# EAGLE design Quadcopter (EAGLE 7.7.0)
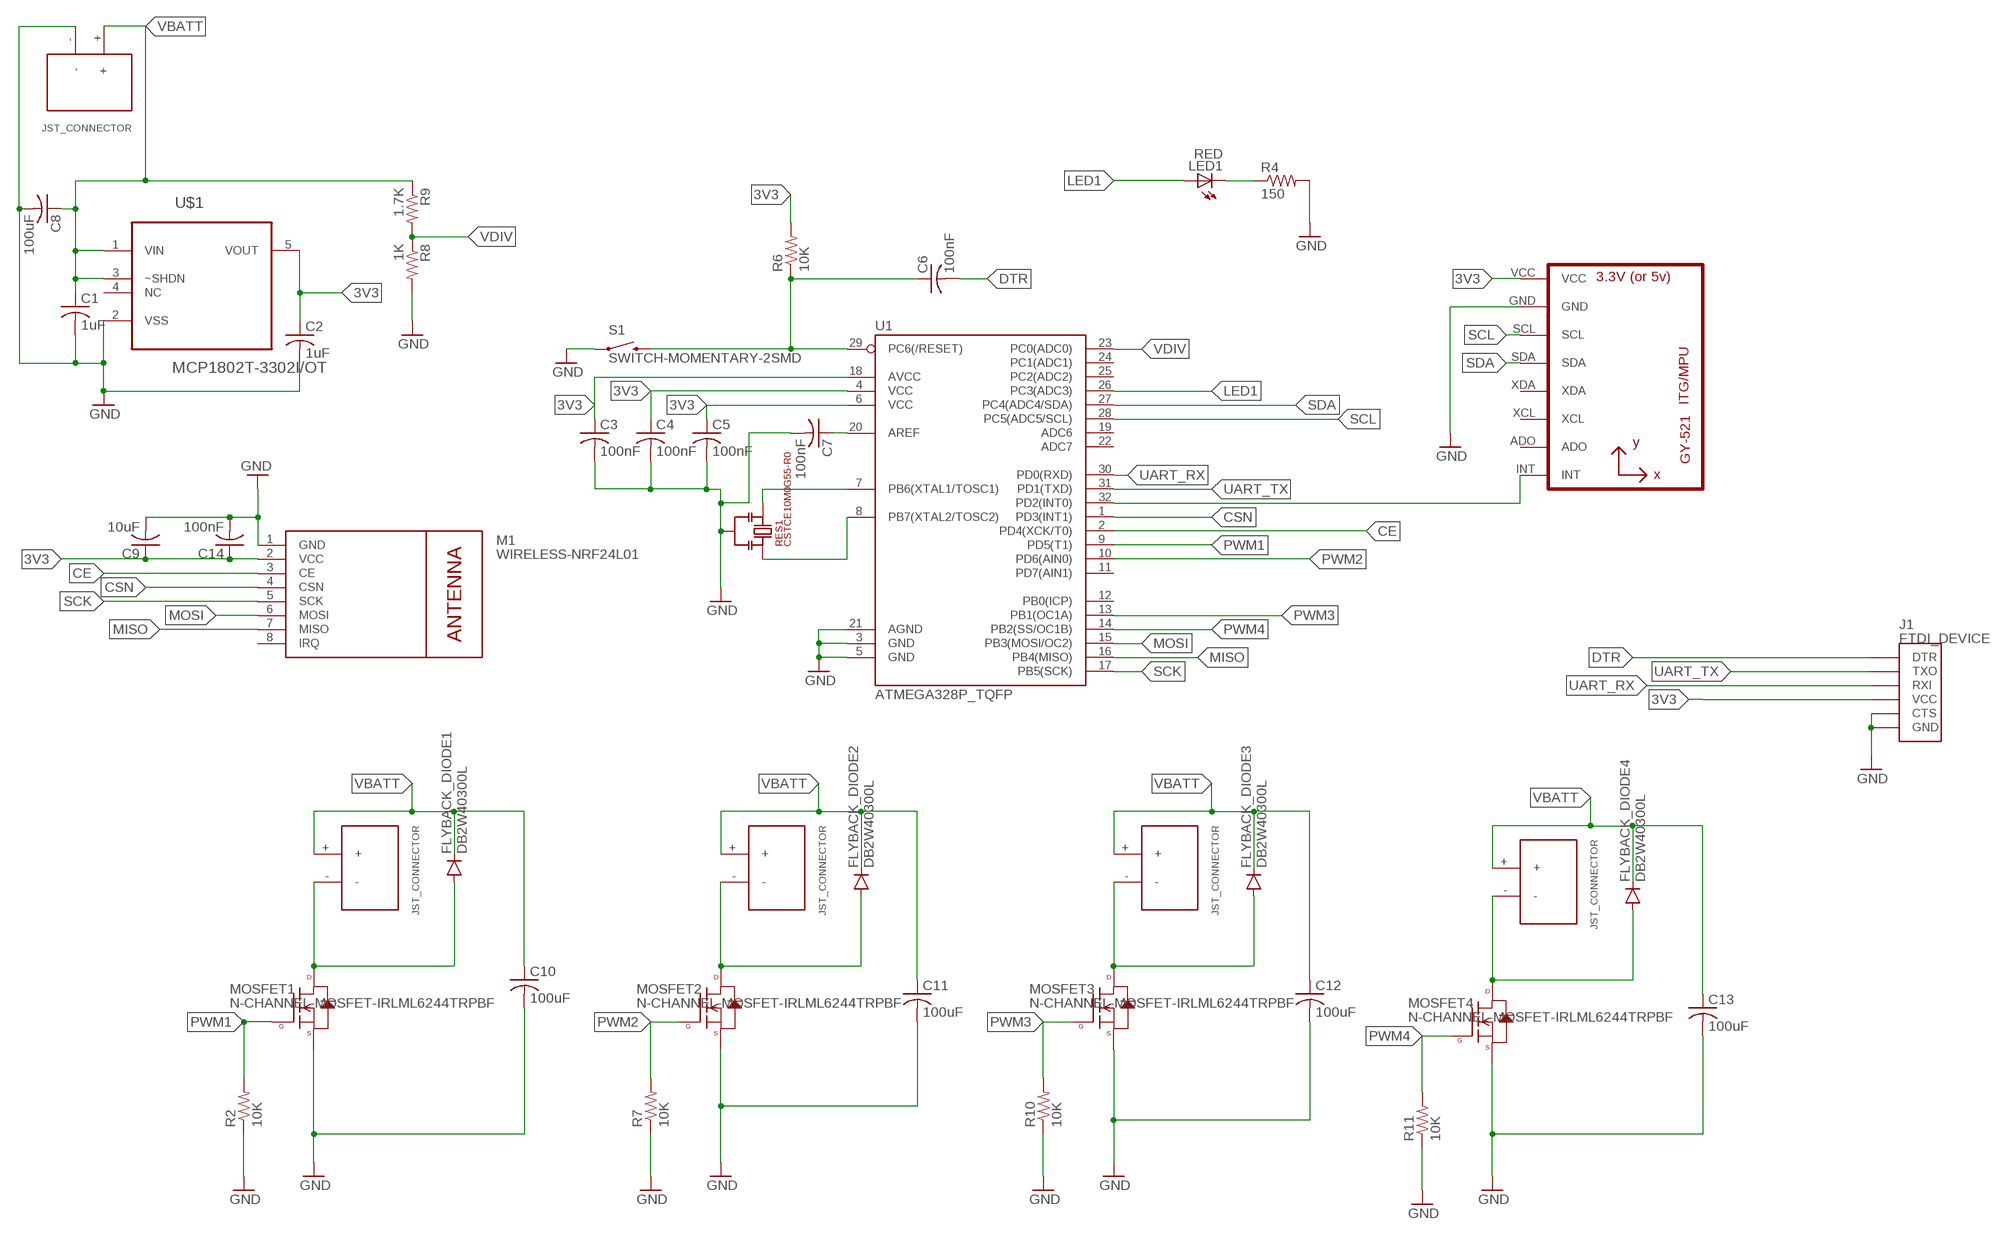
[diagram p0: schematic, sheet 1]

## Parts
C1  1uF  C-USC0603  [C0603]
C2  1uF  C-USC0603  [C0603]
C3  100nF  C-USC0603  [C0603]
C4  100nF  C-USC0603  [C0603]
C5  100nF  C-USC0603  [C0603]
C6  100nF  C-USC0603  [C0603]
C7  100nF  C-USC0603  [C0603]
C8  100uF  C-USC1210  [C1210]
C9  10uF  C-USC0603  [C0603]
C10  100uF  C-USC1210  [C1210]
C11  100uF  C-USC1210  [C1210]
C12  100uF  C-USC1210  [C1210]
C13  100uF  C-USC1210  [C1210]
C14  100nF  C-USC0603  [C0603]
FLYBACK_DIODE1  DB2W40300L  [MINI2-F3-B]
FLYBACK_DIODE2  DB2W40300L  [MINI2-F3-B]
FLYBACK_DIODE3  DB2W40300L  [MINI2-F3-B]
FLYBACK_DIODE4  DB2W40300L  [MINI2-F3-B]
J1  FTDI_DEVICE  [FTDI_DEVICE_SIDE]
LED1  RED  LEDCHIP-LED0603  [CHIP-LED0603]
M1  WIRELESS-NRF24L01  [WIRELESS-NRF24L01]
MOSFET1  N-CHANNEL-MOSFET-IRLML6244TRPBF  [SOT23-3]
MOSFET2  N-CHANNEL-MOSFET-IRLML6244TRPBF  [SOT23-3]
MOSFET3  N-CHANNEL-MOSFET-IRLML6244TRPBF  [SOT23-3]
MOSFET4  N-CHANNEL-MOSFET-IRLML6244TRPBF  [SOT23-3]
MOTOR  JST_CONNECTOR_FEMALE  [JST_CONNECTOR_FEMALE]
MOTOR1  JST_CONNECTOR_FEMALE  [JST_CONNECTOR_FEMALE]
MOTOR2  JST_CONNECTOR_FEMALE  [JST_CONNECTOR_FEMALE]
MOTOR3  JST_CONNECTOR_FEMALE  [JST_CONNECTOR_FEMALE]
R2  10K  R-US_R0603  [R0603]
R4  150  R-US_R0603  [R0603]
R6  10K  R-US_R0603  [R0603]
R7  10K  R-US_R0603  [R0603]
R8  1K  R-US_R0603  [R0603]
R9  1.7K  R-US_R0603  [R0603]
R10  10K  R-US_R0603  [R0603]
R11  10K  R-US_R0603  [R0603]
RES1  CSTCE10M0G55-R0  CSTCE-RESONATOR  [CSTCE16M0V53-R0]
S1  SWITCH-MOMENTARY-2SMD  [TACTILE-SWITCH-SMD]
U1  ATMEGA328P_TQFP  [TQFP32-08]
U3  GY-521MPU6050  [GY-521]
U$1  MCP1802T-3302I/OT  MCP1802T-3002I/OT  [SOT95P270X145-5N]
U$2  JST_Battery  JST_CONNECTOR_FEMALE  [JST_CONNECTOR_FEMALE]

## Nets
3V3: C2.1 C3.1 C4.1 C5.1 C9.1 C14.1 J1.P$4(VCC) M1.2(VCC) R6.2 U1.4(VCC) U1.6(VCC) U1.18(AVCC) U3.VCC U$1.5(VOUT)
ACC_INT: U1.32(PD2(INT0)) U3.INT
AREF: C7.1 U1.20(AREF)
CE: M1.3(CE) U1.2(PD4(XCK/T0))
CSN: M1.4(CSN) U1.1(PD3(INT1))
DRAIN1: FLYBACK_DIODE1.POS(PPIN) MOSFET1.3(D) MOTOR.-
DRAIN2: FLYBACK_DIODE2.POS(PPIN) MOSFET2.3(D) MOTOR1.-
DRAIN3: FLYBACK_DIODE3.POS(PPIN) MOSFET3.3(D) MOTOR2.-
DRAIN4: FLYBACK_DIODE4.POS(PPIN) MOSFET4.3(D) MOTOR3.-
DTR: C6.2 J1.P$1(DTR)
GND: C1.2 C2.2 C3.2 C4.2 C5.2 C7.2 C8.2 C9.2 C10.2 C11.2 C12.2 C13.2 C14.2 J1.P$5(CTS) J1.P$6(GND) M1.1(GND) MOSFET1.2(S) MOSFET2.2(S) MOSFET3.2(S) MOSFET4.2(S) R2.1 R4.2 R7.1 R8.2 R10.1 R11.1 RES1.P$2 S1.1 U1.3(GND) U1.5(GND) U1.21(AGND) U3.GND U$1.2(VSS) U$2.-
LED1: LED1.A U1.26(PC3(ADC3))
LEDRESISTOR: LED1.C R4.1
MISO: M1.7(MISO) U1.16(PB4(MISO))
MOSI: M1.6(MOSI) U1.15(PB3(MOSI/OC2))
PWM1: MOSFET1.1(G) R2.2 U1.9(PD5(T1))
PWM2: MOSFET2.1(G) R7.2 U1.10(PD6(AIN0))
PWM3: MOSFET3.1(G) R10.2 U1.13(PB1(OC1A))
PWM4: MOSFET4.1(G) R11.2 U1.14(PB2(SS/OC1B))
RST: C6.1 R6.1 S1.3 U1.29(PC6(/RESET))
SCK: M1.5(SCK) U1.17(PB5(SCK))
SCL: U1.28(PC5(ADC5/SCL)) U3.SCL
SDA: U1.27(PC4(ADC4/SDA)) U3.SDA
UART_RX: J1.P$3(RXI) U1.30(PD0(RXD))
UART_TX: J1.P$2(TXO) U1.31(PD1(TXD))
VBATT: C1.1 C8.1 C10.1 C11.1 C12.1 C13.1 FLYBACK_DIODE1.NEG(GPIN) FLYBACK_DIODE2.NEG(GPIN) FLYBACK_DIODE3.NEG(GPIN) FLYBACK_DIODE4.NEG(GPIN) MOTOR1.+ MOTOR2.+ MOTOR3.+ MOTOR.+ R9.1 U$1.1(VIN) U$1.3(~SHDN) U$2.+
VDIV: R8.1 R9.2 U1.23(PC0(ADC0))
XTAL1: RES1.P$3 U1.7(PB6(XTAL1/TOSC1))
XTAL2: RES1.P$1 U1.8(PB7(XTAL2/TOSC2))
Unconnected: M1.8(IRQ) U1.11(PD7(AIN1)) U1.12(PB0(ICP)) U1.19(ADC6) U1.22(ADC7) U1.24(PC1(ADC1)) U1.25(PC2(ADC2)) U3.ADO U3.XCL U3.XDA U$1.4(NC)

## Library data of the parts
C1-C14 = rcl:C-US: CAPACITOR, American symbol
FLYBACK_DIODE1-FLYBACK_DIODE4 = quad:DB2W40300L
J1 = quad:FTDI_DEVICE: Connector which mates to FTDI basic or FTDI cable.
LED1 = led:LED: LED OSRAM: - CHIPLED LG R971, LG N971, LY N971, LG Q971, LY Q971, LO R971, LY R971 LH N974, LH R974 LS Q976, LO Q976, LY Q976 LO Q996 - Hyper CHIPLED LW Q18S LB Q993, LB Q99A, LB R99A - SideLED LS A670, LO A670, LY A670, LG A670, LP A670 LB A673, LV A673, LT A673, LW A673 LH A674 LY A675 LS A676, LA A676, LO A676, LY A676, LW A676 LS A679, LY A679, LG A679 - Hyper Micro SIDELED® LS Y876, LA Y876, LO Y876, LY Y876 LT Y87S - SmartLED LW L88C, LW L88S LB L89C, LB L89S, LG L890 LS L89K, LO L89K, LY L89K LS L896, LA L896, LO L896, LY L896 - TOPLED LS T670, LO T670, LY T670, LG T670, LP T670 LSG T670, LSP T670, LSY T670, LOP T670, LYG T670 LG T671, LOG T671, LSG T671 LB T673, LV T673, LT T673, LW T673 LH T674 LS T676, LA T676, LO T676, LY T676, LB T676, LH T676, LSB T676, LW T676 LB T67C, LV T67C, LT T67C, LS T67K, LO T67K, LY T67K, LW E67C LS E67B, LA E67B, LO E67B, LY E67B, LB E67C, LV E67C, LT E67C LW T67C LS T679, LY T679, LG T679 LS T770, LO T770, LY T770, LG T770, LP T770 LB T773, LV T773, LT T773, LW T773 LH T774 LS E675, LA E675, LY E675, LS T675 LS T776, LA T776, LO T776, LY T776, LB T776 LHGB T686 LT T68C, LB T68C - Hyper Mini TOPLED® LB M676 - Mini TOPLED Santana® LG M470 LS M47K, LO M47K, LY M47K Source: http://www.osram.convergy.de LUXEON: - LUMILED® LXK2-PW12-R00, LXK2-PW12-S00, LXK2-PW14-U00, LXK2-PW14-V00 LXK2-PM12-R00, LXK2-PM12-S00, LXK2-PM14-U00 LXK2-PE12-Q00, LXK2-PE12-R00, LXK2-PE12-S00, LXK2-PE14-T00, LXK2-PE14-U00 LXK2-PB12-K00, LXK2-PB12-L00, LXK2-PB12-M00, LXK2-PB14-N00, LXK2-PB14-P00, LXK2-PB14-Q00 LXK2-PR12-L00, LXK2-PR12-M00, LXK2-PR14-Q00, LXK2-PR14-R00 LXK2-PD12-Q00, LXK2-PD12-R00, LXK2-PD12-S00 LXK2-PH12-R00, LXK2-PH12-S00 LXK2-PL12-P00, LXK2-PL12-Q00, LXK2-PL12-R00 Source: www.luxeon.com KINGBRIGHT: KA-3528ASYC Source: www.kingbright.com
M1 = quad:WIRELESS-NRF24L01: 2.4 GHz Wireless Module based on NRF24L01 chip
MOSFET1-MOSFET4 = quad:N-CHANNEL-MOSFET: N-Channel MOSFET Mode Field Effect Transistor; DATASHEET: http://www.mouser.com/ds/2/196/irlml6244pbf-936666.pdf; MOUSER: 942-IRLML6244TRPBF; URL: http://www.mouser.com/Search/ProductDetail.aspx?R=IRLML6244TRPBFvirtualkey57370000virtualkey942-IRLML6244TRPBF
MOTOR MOTOR1-MOTOR3 U$2 = quad:JST_CONNECTOR_FEMALE
R2 R4 R6-R11 = rcl:R-US_: RESISTOR, American symbol
RES1 = quad:CSTCE-RESONATOR: Murata Electronics Resonator
S1 = quad:SWITCH-MOMENTARY-2: Various NO switches- pushbuttons, reed, etc; PROD_ID: SWCH-08247
U1 = quad:ATMEGA328P_TQFP; PROD_ID: IC-09069
U3 = quad:GY-521
U$1 = quad:MCP1802T-3002I/OT: Low Quiescent Current LDO; MPN: MCP1802T-3002I/OT; OC_FARNELL: 1578373; OC_NEWARK: 54M4837; PACKAGE: SOT-5; SUPPLIER: Microchip

## Board
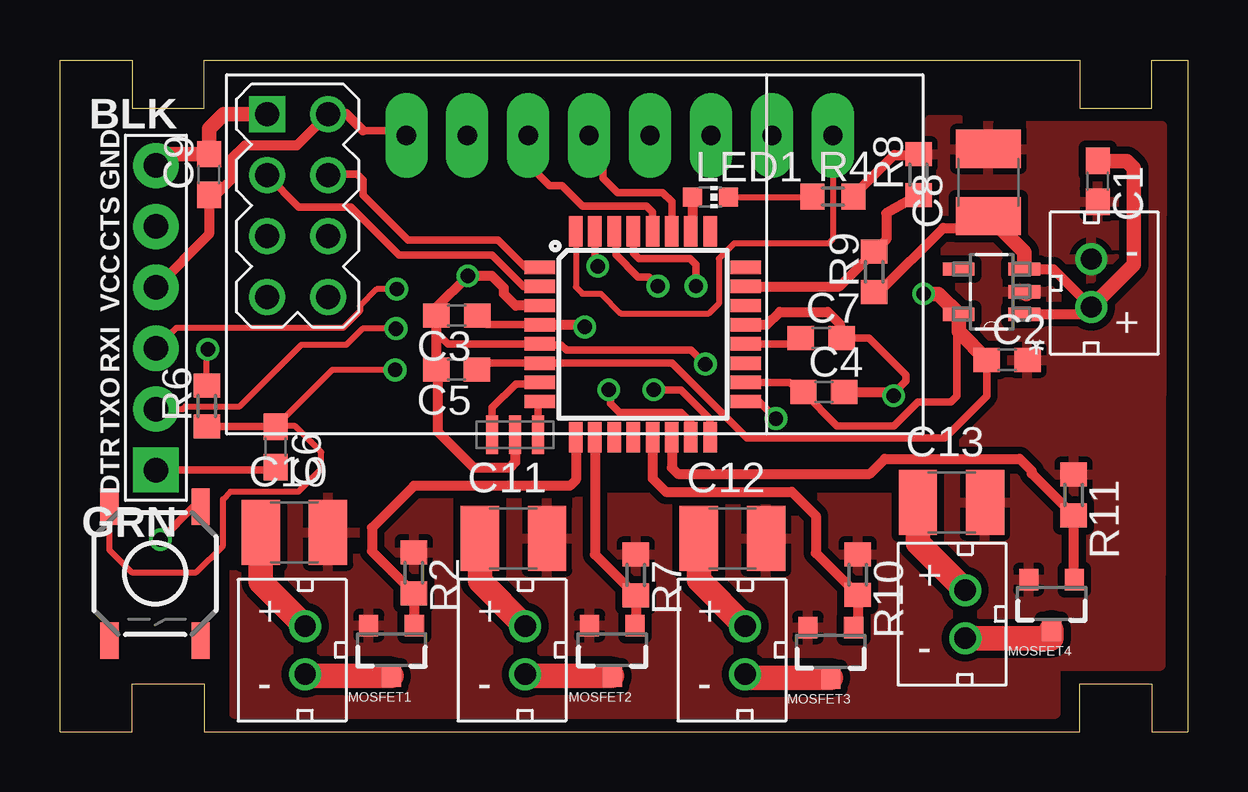
[diagram p1: board, top side]
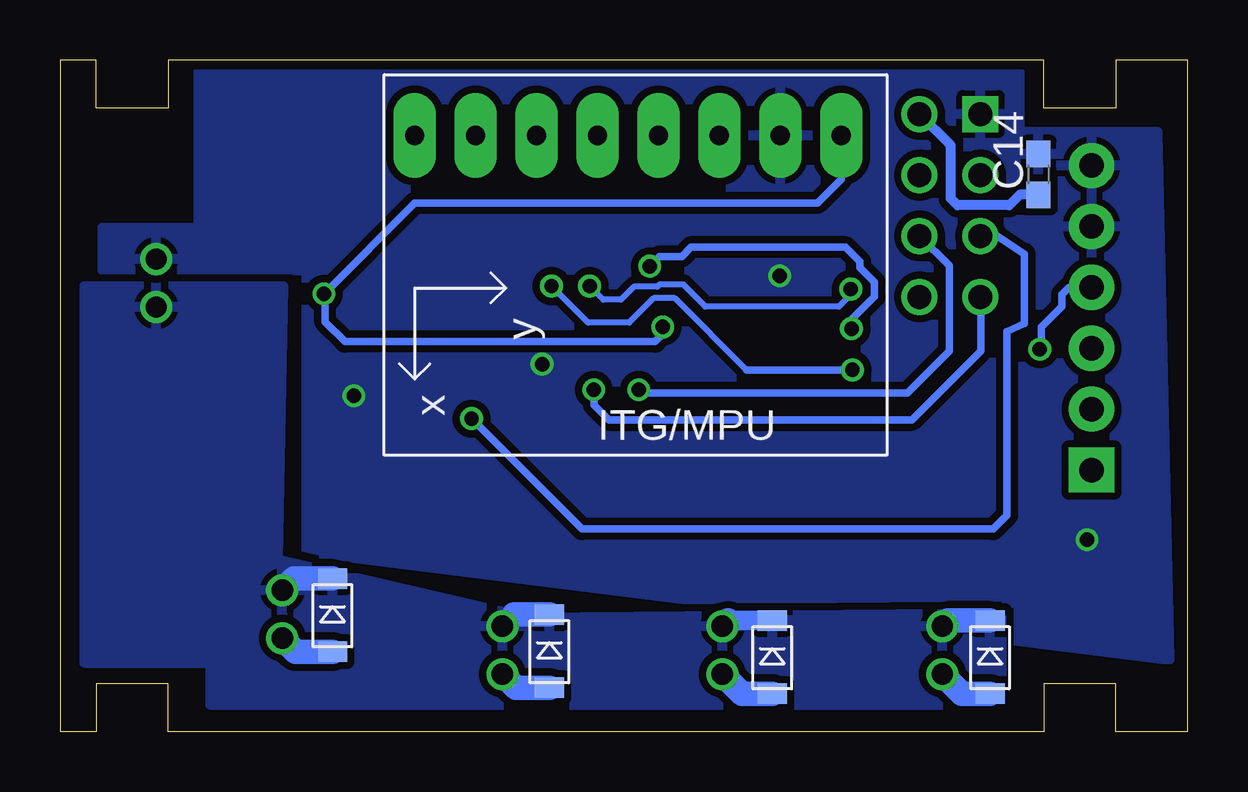
[diagram p2: board, bottom side, seen from below]

Size 47 x 28 mm. Coordinates in mm from the lower left corner, seen from the top.
Outline: 0,0 0,28 3,28 3,26 6,26 6,28 42.5,28 42.5,26 45.5,26 45.5,28 47,28 47,0 45.5,0 45.5,2 42.5,2 42.5,0 6,0 6,2 3,2 3,0 0,0
Copper layers (1*16): Top 0.0356mm / dielectric 1.5011mm / Bottom 0.0356mm
Design rules "LaenPCBOrder": minimum track width 6mil, minimum drill 13mil, track to track 6mil, track to pad 6mil, pad to pad 6mil, via to via 6mil, smd to smd 6mil, copper to edge 15mil, drill to drill 6mil, minimum pad ring 7mil, minimum via ring 7mil, stop-mask expansion 3mil, vias tented up to drill 0mil, thermal gap 10mil

### Footprints (pad centres in the part's own frame; a part is rotated, then mirrored left to right if it is on the bottom)
C0603 = smd 1.1 x 1: 1 -0.85,0; 2 0.85,0
C1210 = smd 1.6 x 2.7: 1 -1.4,0; 2 1.4,0
MINI2-F3-B = smd 1.22 x 0.85: NEG 0,1.55; POS 0,-1.5
FTDI_DEVICE_SIDE = drill 1.016 pad 1.88 square: P$1 -6.35,0 | drill 1.016 pad 1.88: P$2 -3.81,0; P$3 -1.27,0; P$4 1.27,0; P$5 3.81,0; P$6 6.35,0
CHIP-LED0603 = smd 0.8 x 0.8: A 0,-0.75; C 0,0.75
WIRELESS-NRF24L01 = drill 1 square: 1 -12.7,6.35 | drill 1: 2 -10.16,6.35; 3 -12.7,3.81; 4 -10.16,3.81; 5 -12.7,1.27; 6 -10.16,1.27; 7 -12.7,-1.27; 8 -10.16,-1.27
SOT23-3 = smd 0.8 x 0.9: 1 -0.95,-1; 2 0.95,-1; 3 0,1.1
JST_CONNECTOR_FEMALE = drill 0.889: + 0,1; - 0,-1
R0603 = smd 1 x 1.1: 1 -0.85,0; 2 0.85,0
CSTCE16M0V53-R0 = smd 1.6 x 0.5: P$1 0,0.95; P$2 0,0; P$3 0,-0.95
TACTILE-SWITCH-SMD = smd 1.524 x 0.762: 1 -2.794,1.905; 2 2.794,1.905; 3 -2.794,-1.905; 4 2.794,-1.905
TQFP32-08 = smd 1.27 x 0.559: 1 -4.293,2.8; 2 -4.293,2; 3 -4.293,1.2; 4 -4.293,0.4; 5 -4.293,-0.4; 6 -4.293,-1.2; 7 -4.293,-2; 8 -4.293,-2.8; 17 4.293,-2.8; 18 4.293,-2; 19 4.293,-1.2; 20 4.293,-0.4; 21 4.293,0.4; 22 4.293,1.2; 23 4.293,2; 24 4.293,2.8 | smd 0.559 x 1.27: 9 -2.8,-4.293; 10 -2,-4.293; 11 -1.2,-4.293; 12 -0.4,-4.293; 13 0.4,-4.293; 14 1.2,-4.293; 15 2,-4.293; 16 2.8,-4.293; 25 2.8,4.293; 26 2,4.293; 27 1.2,4.293; 28 0.4,4.293; 29 -0.4,4.293; 30 -1.2,4.293; 31 -2,4.293; 32 -2.8,4.293
GY-521 = drill 0.8 pad 1.778 long: ADO -8.89,-6.35; GND -8.89,6.35; INT -8.89,-8.89; SCL -8.89,3.81; SDA -8.89,1.27; VCC -8.89,8.89; XCL -8.89,-3.81; XDA -8.89,-1.27
SOT95P270X145-5N = smd 1.321 x 0.559: 1 -1.372,0.94; 2 -1.372,0; 3 -1.372,-0.94; 4 1.372,-0.94; 5 1.372,0.94

### Placement (x,y rotation side)
C1  43.25,22.94 270 top
C2  39.48,15.5 0 top
C3  16.54,17.35 180 top
C4  31.84,14.15 0 top
C5  16.53,15.1 180 top
C6  8.98,11.87 270 top
C7  31.73,16.4 0 top
C8  38.7,22.89 90 top
C9  6.21,23.22 90 top
C10  9.77,8.3 0 top
C11  18.9,8.05 0 top
C12  28.03,8.05 0 top
C13  37.16,9.55 0 top
C14  6.21,23.23 90 bottom
FLYBACK_DIODE1  8.23,3.08 0 bottom
FLYBACK_DIODE2  17.31,3.08 0 bottom
FLYBACK_DIODE3  26.6,3.33 0 bottom
FLYBACK_DIODE4  35.64,4.83 0 bottom
J1  4,17.25 90 top
LED1  27.11,22.28 270 top
M1  21.33,19.39 0 top
MOSFET1  13.82,3.42 180 top
MOSFET2  23.02,3.42 180 top
MOSFET3  32.13,3.34 180 top
MOSFET4  41.33,5.34 180 top
MOTOR  10.22,3.39 0 top
MOTOR1  19.39,3.39 0 top
MOTOR2  28.56,3.39 0 top
MOTOR3  37.73,4.89 0 top
R2  14.75,6.62 270 top
R4  32.22,22.3 0 top
R6  6.12,13.57 90 top
R7  24,6.53 270 top
R8  35.79,23.22 90 top
R9  33.94,19.16 90 top
R10  33.25,6.54 270 top
R11  42.25,9.86 270 top
RES1  18.97,12.38 270 top
S1  3.96,6.59 270 top
U1  24.3,16.56 0 top
U3  23.33,15.96 270 bottom
U$1  38.83,18.34 180 top
U$2  42.99,18.7 180 top

### Tracks (layer width: path | path; a pad name or v marks a point on that pad's centre or on a via)
3V3  (via drill 0.6)
  Top 0.254: R6.2 6.12,15.9 v6.16,15.94
  Top 0.305: C3.1 17.78,16.96 U1.4 19.46,16.96 | C5.1 17.64,15.36 U1.6 25.52,15.36 28.62,12.25 36.88,12.25 38.62,14 C2.1 | 29.32,14.56 U1.18 30.4,14.56 C4.1 32.39,12.75 34.75,12.75 35.75,13.75 37.12,13.75 37.38,14 37.38,16.67 37.46,16.75 | 12.62,25.06 14.22,25.06 U3.VCC
  Top 0.406: U1.4 21.71,16.96 v21.88,16.87 | 12.62,25.06 11.95,25.74 M1.2 9.88,24.45 7.71,24.45 7.14,23.88 7.14,23.02 6.5,22.37 C9.1 6.21,20.73 J1.P$4
  Top 0.61: C2.1 37.46,16.67 37.46,16.75 U$1.5 36.61,18.25 v36,18.25
  Bottom 0.305: 32.21,22.04 32.22,22.04 | 32.22,22.04 v36,18.25 35.94,18.19 35.94,17.08 35.12,16.26 22.19,16.26 21.88,16.57 v21.88,16.87 | U3.VCC 14.44,23.03 15.43,22.04 32.22,22.04 | J1.P$4 4.94,18.52 5.24,18.22 5.24,17.72 6.1,16.86 6.1,16 v6.16,15.94
  Bottom 0.406: C14.1 6.99,22.38 7.43,21.94 9.59,21.94 9.87,22.23 9.87,24.44 M1.2
ACC_INT
  Top 0.254: U3.INT 32.22,20.53 32.04,20.35 28.1,20.35 27.46,19.72 27.46,17.84 27.05,17.43 23.37,17.43 22.54,18.26 21.78,18.26 21.5,18.54 U1.32
  Top 0.305: U1.32
AREF
  Top 0.305: C7.1 31.12,16.16 U1.20
CE
  Top 0.305: U1.2 19.32,18.56 18,19.88 14.12,19.88 12.12,21.88 9.96,21.88 M1.3
CSN
  Top 0.305: U1.1 19.39,19.36 18.25,20.5 14.5,20.5 12.62,22.38 12.62,23 12.38,23.25 11.22,23.25 M1.4
DRAIN1
  Top 1.016: MOSFET1.3 10.29,2.32 MOTOR.-
  Bottom 1.016: FLYBACK_DIODE1.POS 9.41,1.58 MOTOR.-
DRAIN2
  Top 1.016: MOSFET2.3 19.46,2.32 MOTOR1.-
  Bottom 1.016: FLYBACK_DIODE2.POS 18.58,1.58 MOTOR1.-
DRAIN3
  Top 1.016: MOSFET3.3 28.71,2.24 MOTOR2.-
  Bottom 1.016: FLYBACK_DIODE3.POS 28,1.83 MOTOR2.-
DRAIN4
  Top 1.016: MOTOR3.- 41.33,3.89 MOSFET4.3
  Bottom 1.016: FLYBACK_DIODE4.POS 37.17,3.33 MOTOR3.-
DTR
  Top 0.305: J1.P$1 8.87,10.9 C6.2
GND  (via drill 0.6)
  Top 0.305: C7.2 33.73,16.4 35.25,14.88 35.25,14.62 34.75,14.12 v34.75,14 | S1.1 5.57,9.38 v4.19,8 | v26.9,15.31 26.31,15.91 21.11,15.91 20.89,16.12 20.04,16.12 | U1.5 16.17,16.16 15.69,16.64
  Top 0.406: RES1.P$2 18.97,11.22 18.75,11 17.25,11 15.75,12.5 15.75,15.03 C5.2 15.69,16.64 C3.2 15.69,17.69 v17,19 18,19 18.5,18.5 18.5,18.25 18.99,17.76 U1.3 | U1.21 29.46,16.96 30,17.5 32,17.5 32.5,17 32.5,16.48 C7.2 | 32.58,14.26 C4.2 34.6,14.15 v34.75,14 | 20.04,16.12 U1.5 | R4.2 33.07,22.34 34.77,24.04 35.75,24.04 R8.2
  Top 0.61: 40.29,18.25 U$1.2 | J1.P$6 4.47,24.07 C9.2 6.21,25.13 6.83,25.75 M1.1
  pour Top (isolate 0.305): 36.25,25.5 36.25,9.75 7.25,9.75 7.25,0.75 41.5,0.75 41.5,2.75 45.88,2.75 45.94,25.25 37.5,25.25 37.5,25.5
  pour Bottom (isolate 0.305, rank 2): 1.25,25 7,25 7,27.48 41.25,27.48 41.25,21 45.25,21 45.25,19.25 36.75,19.25 36.75,7.5 0.75,3
LED1
  Top 0.305: 26.36,20.91 U1.26
  Top 0.406: LED1.A 26.36,20.91
LEDRESISTOR
  Top 0.254: LED1.C 31.35,22.28 R4.1
MISO  (via drill 0.6)
  Top 0.305: U1.16 27.1,13.03 25.88,14.25 v24.75,14.25
  Bottom 0.305: M1.7 8.62,15.88 11.5,13 24.12,13 24.75,13.62 v24.75,14.25
MOSI  (via drill 0.6)
  Top 0.305: v22.88,14.25 22.94,14.19 22.94,13.69 23.31,13.31 25.88,13.31 26.3,12.89 U1.15
  Bottom 0.305: M1.6 9.94,19.43 9.94,15.88 11.69,14.12 22.75,14.12 v22.88,14.25
PWM1
  Top 0.406: MOSFET1.1 14.75,4.44 R2.2 13,7.52 13,8.5 14.75,10.25 21.25,10.25 21.5,10.5 U1.9
PWM2
  Top 0.406: MOSFET2.1 24,4.45 R7.2 22.3,7.38 U1.10
PWM3
  Top 0.406: MOSFET3.1 33.25,4.51 R10.2 31.5,7.44 31.5,9 30.5,10 25.25,10 24.7,10.55 U1.13
PWM4
  Top 0.406: MOSFET4.1 42.25,6.34 R11.2 40.5,10.76 40.5,10.88 40,11.38 34.38,11.38 33.75,10.75 25.75,10.75 25.5,11 U1.14
RST  (via drill 0.6)
  Top 0.254: S1.3 2.06,7.56 2.98,6.64 5.68,6.64 6.79,7.75 6.79,9.68 7.11,10 9.94,10 10.89,10.95 10.89,11.65 9.81,12.73 9,12.73 C6.1 11.35,15.08 v13.97,15.08
  Top 0.305: U1.29 23.9,19.95 24.13,19.72 26.26,19.72 26.51,19.46 v26.51,18.57 | R6.1 C6.1
  Bottom 0.254: 18.38,15.08 21.37,18.07 22.26,18.07 23.27,17.05 24.99,17.05 v26.51,18.57
  Bottom 0.305: v13.97,15.08 18.38,15.08
SCK  (via drill 0.6)
  Top 0.305: U1.17 29.13,13.76 v29.84,13.05
  Bottom 0.305: M1.5 7.93,20.66 6.79,19.91 6.79,17.02 7.53,16.67 7.53,9.02 8.1,8.45 25.24,8.45 v29.84,13.05
SCL
  Top 0.305: U1.28 24.7,21.66 24.45,21.91 21.78,21.91 20.92,22.77 20.41,22.77 19.49,23.69 19.49,24.83 U3.SCL
SDA
  Top 0.305: U1.27 25.5,22.09 25.11,22.48 23.24,22.48 22.64,23.08 22.64,24.27 U3.SDA
UART_RX  (via drill 0.6)
  Top 0.254: v14.03,18.45 13.21,18.45 12.51,17.75 12.51,17.53 11.81,16.83 4.85,16.83 J1.P$3
  Top 0.305: v24.92,18.57 24.54,18.95 24.1,18.95 23.18,19.88 23.18,20.77 U1.30
  Bottom 0.254: v24.92,18.57 24.35,18 23.62,18 23.08,18.54 22.1,18.54 22,18.64 21.02,18.64 20.1,17.72 14.54,17.72 14.03,18.22 v14.03,18.45
UART_TX  (via drill 0.6)
  Top 0.254: v14,16.8 12.61,16.8 11.94,16.13 10.06,16.13 7.49,13.56 5.24,13.56 5.12,13.44 J1.P$2
  Top 0.305: U1.31 22.3,19.48 v22.42,19.4
  Bottom 0.305: v14,16.8 14,17.18 13.05,18.13 13.05,18.73 13.65,19.34 13.65,19.59 14.26,20.19 20.7,20.19 21.08,19.81 22,19.81 v22.42,19.4
VBATT
  Top 0.406: U$1.1 42.69,17.4 U$2.+ 41.41,19.28 U$1.3 | R9.1 34.13,18.32 36.81,21 38.21,21 C8.1
  Top 0.61: U$1.3 40.2,19.99 C8.1 | C1.1 44.46,23.79 44.75,23.5 44.75,19.46 U$2.+
  Top 0.813: 38.47,21.26 C8.1 | C10.1 8.45,8.3 8.5,8.25
  Top 1.016: C10.1 8.37,6.24 MOTOR.+ | C11.1 17.5,6.28 MOTOR1.+ | C12.1 26.63,6.32 MOTOR2.+ | C13.1 35.76,7.86 MOTOR3.+
  Bottom 0.813: FLYBACK_DIODE2.NEG 19.15,4.63 | 9.98,4.63 MOTOR.+ | 28.07,4.88 MOTOR2.+
  Bottom 1.016: FLYBACK_DIODE4.NEG 37.24,6.38 MOTOR3.+ | FLYBACK_DIODE1.NEG 9.98,4.63 | 19.15,4.63 MOTOR1.+ | FLYBACK_DIODE3.NEG 28.07,4.88
  pour Bottom (isolate 0.305): 37.68,18.56 46,18.56 46,2.88 40.75,2.88 40.75,1.12 7.75,1.12 7.75,4.94 27.5,4.75 37.9,7.15
VDIV
  Top 0.406: R8.1 34.44,21.61 34.44,20.52 R9.2 32.48,18.56 U1.23
XTAL1
  Top 0.305: RES1.P$3 18.02,13.52 19,14.5 19.95,14.5
  Top 0.406: 19.95,14.5 U1.7
XTAL2
  Top 0.305: RES1.P$1 19.92,13.67 U1.8